# Altium schematic sheet EEPROM.SchDoc: Raspberry Pi EEPROM
size 203 x 127 mm; DrawnBy: Kace Chandler
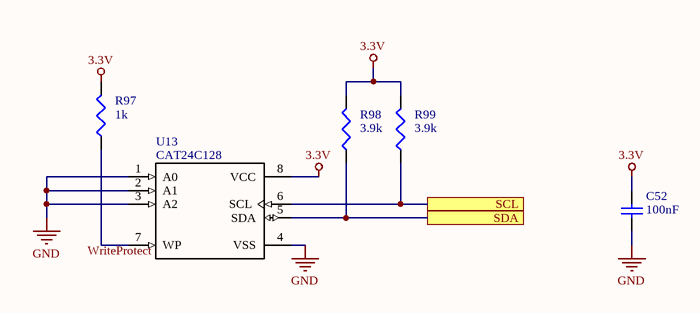
[diagram p0: EEPROM.SchDoc]

## Parts
C52  value 100nF  [0603 to 0805 SMD]  (hidden comment: Cap)
R97  value 1k  [0603 Footprint]  (hidden comment: Res3)
R98  value 3.9k  [0603 Footprint]  (hidden comment: Res3)
R99  value 3.9k  [0603 Footprint]  (hidden comment: Res3)
U13  CAT24C128  [EEPROM]

## Ports
SCL, SDA

## Nets
3.3V: C52.2 R97.2 R98.2 R99.2 U13.8(VCC)
GND: C52.1 U13.1(A0) U13.2(A1) U13.3(A2) U13.4(VSS)
SCL: R99.1 U13.6(SCL) ; port SCL
SDA: R98.1 U13.5(SDA) ; port SDA
NetR97_1: R97.1 U13.7(WP)

## Notes on the sheet
- Labels drawn without touching a wire or pin: WriteProtect

## Library data of the parts
R97-R99 = Res3: Resistor; Published: 8-Jun-2000; LatestRevisionDate: 29-May-2009; LatestRevisionNote: IPC-7351 Footprint Added.; PackageReference: J1-0603; Publisher: Altium Limited; PackageDescription: Chip Resistor
U13 = CAT24C128HU4IGT3: EEPROM Serial-I2C 128K-bit 16K x 8 2.5V/3.3V/5V 8-Pin UDFN EP T/R; MF: ON Semiconductor; Package: UFDFN-8 ON Semiconductor; Price: None; MP: CAT24C128HU4IGT3; Availability: Unavailable; SnapEDA_Link: https://www.snapeda.com/parts/CAT24C128HU4IGT3/ON%20Semiconductor/view-part/?ref=snap; Value: *; Supplier 1: Digi-Key; Supplier Part Number 1: CAT24C128HU4IGT3OSDKR-ND